# Altium schematic sheet tactile_power.SchDoc
size A; SheetNumber: 1; SheetTotal: 5
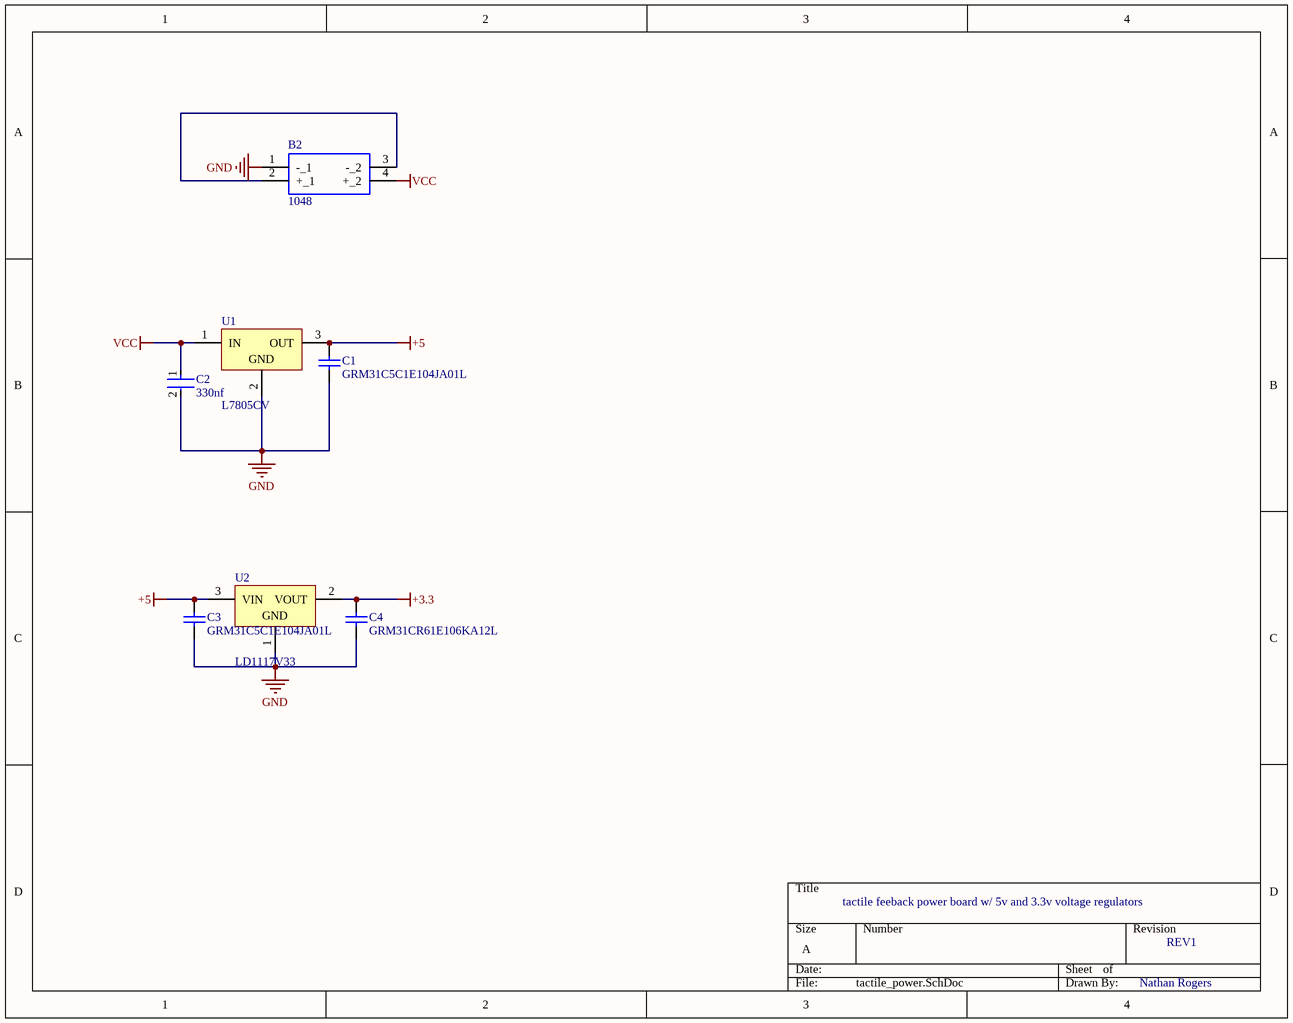
[diagram p0: tactile_power.SchDoc]

## Parts
B2  1048  [1048]
C1  GRM31C5C1E104JA01L  [CAPC3216X180X55LL20T25]
C2  330nf  [FP-1206-L_3_2_0_2-W_1_6_0-IPC_B]
C3  GRM31C5C1E104JA01L  [CAPC3216X180X55LL20T25]
C4  GRM31CR61E106KA12L  [CAPC3216X180X55ML20T25]
U1  L7805CV  [TO220]
U2  LD1117V33  [TO220]

## Nets
+3.3: C4.2 U2.2(VOUT)
+5: C1.2 C3.2 U1.3(OUT) U2.3(VIN)
GND: B2.1(-_1) C1.1 C2.2 C3.1 C4.1 U1.2(GND) U2.1(GND)
VCC: B2.4(+_2) C2.1 U1.1(IN)
NetB2_2: B2.2(+_1) B2.3(-_2)

## Notes on the sheet
- tactile feeback power board w/ 5v and 3.3v voltage regulators
- REV1
- Nathan Rogers

## Library data of the parts
B2 = CMP-003-000009-1: KEYSTONE - 1048 - BATTERY HOLDER, 18650 LI-ION, 2CELL, SMD; Manufacturer_Name: Keystone Electronics; Source: 1048.SchLib; Design Item ID: 1048; Mouser Part Number: 534-1048; Mouser Price/Stock: https://www.mouser.co.uk/ProductDetail/Keystone-Electronics/1048?qs=%2F7TOpeL5Mz5jXkg8vI8Dyw%3D%3D; Manufacturer_Part_Number: 1048; Datasheet Link: http://www.keyelco.com/product-pdf.cfm?p=920
C1 C3 = CMP-2000-06343-1: Chip Capacitor, 100 nF, +/- 5%, 25 V, -55 to 125 degC, 1206 (3216 Metric), RoHS, Tape and Reel; Manufacturer: Murata; External Width: 0.5mm; Voltage Rating V DC: 25V; Capacitor Case Style: 1206[3216Metric]; Insulation Resistance: 10000Mohm; Capacitor Terminals: SMD; Capacitance: 0.1µF; Temperature Coefficient: 0ppm/°C±30ppm/°C; External Length / Height: 1mm; Reel Quantity: 2000; Dielectric Characteristic: C0G/NP0; SVHC: NoSVHC(19-Dec-2012); No. of Pins: 2; Manufacturer URL: http://www.murata.com/; Mounting Technology: SurfaceMount; Operating Temperature Range: -55°Cto+125°C; Operating Temperature Max: 125°C; Package Description: 2-Pin Surface Mount Device, Body 3.2 x 1.6 mm; Operating Temperature Min: -55°C; Terminal Type: SurfaceMount(SMD,SMT); MSL: –; Tolerance +: 5%; Voltage Rating: 25V; Datasheet URL: https://datasheet.ciiva.com/3777/11308grm31c5c1e104ja0123-3777177.pdf; Datasheet Version: 09/2014; Package / Case: 1206; Capacitance Tolerance: ±5%; Package Reference: 1206; Lead Spacing: –; Tolerance -: 5%
C2 = CMP-2000-05868-2: General Purpose Ceramic Capacitor, 1206, 330nF, 10%, X7R, 15%, 50V; Insulation Resistance: 100GR; Dissipation Factor: 2.5%; Voltage: 25V; Max Operating Temperature: 125°C; Packaging: Tape and Reel; Number of Pins: 2; Construction: Flat; Tolerance: 10%; RoHS Compliant: Yes; Lead Free: Lead Free; Mount: Surface Mount; Voltage Rating: 50V; Voltage Rating (DC): 50V; Width: 1.6mm; Height: 1.52mm; Termination: SMD/SMT; Min Operating Temperature: -55°C; Contact Plating: Tin; REACH SVHC: No SVHC; Case Code (Imperial): 1206; Thickness: 0.06inch; Radiation Hardening: No; Capacitance: 330nF; Case/Package: 1206; Case Code (Metric): 3216; Dielectric: X7R; Depth: 1.6mm; Dielectric Material: Ceramic; Series: 1206; Package Quantity: 1; Length: 3.2mm
C4 = CMP-2000-04947-1: Chip Capacitor, 10 uF, +/- 10%, 25 V, -55 to 85 degC, 1206 (3216 Metric), RoHS, Tape and Reel; Manufacturer: Murata; Case Height: 1.6mm; Voltage Rating DC: 25V; Capacitance: 10uF; Type: GeneralPurposeMLCC; Dielectric: X5R; Case Length: 3.2mm; Brand: MurataElectronics; Maximum Operating Temperature: +85C; Datasheet URL: https://datasheet.ciiva.com/11786/0900766b80ef921d-11786983.pdf; Tolerance: 10%; Case Code - mm: 3216; Datasheet Version: Sep-13; Packaging: Reel; Product Category: MultilayerCeramicCapacitorsMLCC-SMD/SMT; Manufacturer URL: http://www.murata.com/; Factory Pack Quantity: 2000; Minimum Operating Temperature: -55C; Product: GeneralTypeMLCCs; Package Reference: 1206; RoHS: Details; Package / Case: 1206(3216metric); Package Description: 2-Pin Surface Mount Device, Body 3.2 x 1.6 mm; Case Code - in: 1206; Termination Style: SMD/SMT; Series: GRM; Case Width: 1.6mm
U1 = CMP-0244-00483-1: Positive Voltage Regulator, 5V, 3-Pin TO-220; PackageDescription: TO, Thru-Hole, Vertical, Heatsink Mounted; 3 In-Line Leads; Pitch 2.54 mm; ComponentLink2Description: Datasheet; PackageReference: TO220; ComponentLink3URL: http://www.st.com/internet/com/TECHNICAL_RESOURCES/TECHNICAL_LITERATURE/PACKAGE_INFORMATION/CD00004649.pdf; DatasheetVersion: 16/11/2011; ComponentLink1Description: Manufacturer URL; ComponentLink1URL: http://www.st.com; PackageVersion: ver3.0; ComponentLink3Description: Package Specification; ComponentLink2URL: http://www.st.com/internet/com/TECHNICAL_RESOURCES/TECHNICAL_LITERATURE/DATASHEET/CD00000444.pdf
U2 = CMP-0244-00470-1: Fixed Low Drop Positive Voltage Regulator, 3.3V, 3-Pin TO-220; PackageVersion: ver3.0; PackageDescription: TO, Thru-Hole, Vertical, Heatsink Mounted; 3 In-Line Leads; Pitch 2.54 mm; ComponentLink1Description: Manufacturer URL; ComponentLink3URL: http://www.st.com/internet/com/TECHNICAL_RESOURCES/TECHNICAL_LITERATURE/PACKAGE_INFORMATION/CD00004649.pdf; PackageReference: TO220; ComponentLink2URL: http://www.st.com/internet/com/TECHNICAL_RESOURCES/TECHNICAL_LITERATURE/DATASHEET/CD00000544.pdf; ComponentLink3Description: Package Specification; ComponentLink2Description: Datasheet; ComponentLink1URL: http://www.st.com; DatasheetVersion: 1/11/2011